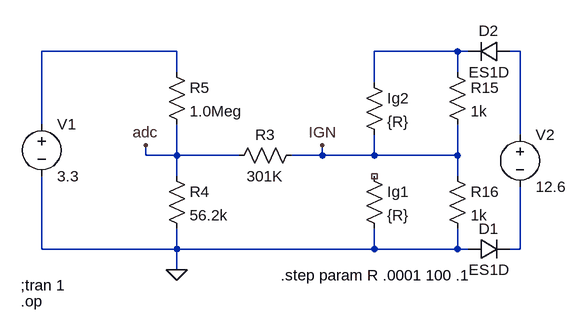
[diagram p0: schematic Cont1Netv2.asc]
Cont1Netv2.asc, the LTspice schematic file:
Version 4
SHEET 1 1220 680
WIRE 160 0 -48 0
WIRE 592 0 464 0
WIRE 608 0 592 0
WIRE 688 0 672 0
WIRE 160 32 160 0
WIRE 592 32 592 0
WIRE 464 48 464 0
WIRE -48 112 -48 0
WIRE 688 128 688 0
WIRE 112 160 112 144
WIRE 160 160 160 112
WIRE 160 160 112 160
WIRE 256 160 160 160
WIRE 384 160 384 144
WIRE 384 160 336 160
WIRE 464 160 464 128
WIRE 464 160 384 160
WIRE 592 160 592 112
WIRE 592 160 464 160
WIRE 160 192 160 160
WIRE 592 192 592 160
WIRE -48 304 -48 192
WIRE 160 304 160 272
WIRE 160 304 -48 304
WIRE 464 304 464 272
WIRE 464 304 160 304
WIRE 592 304 592 272
WIRE 592 304 464 304
WIRE 608 304 592 304
WIRE 688 304 688 208
WIRE 688 304 672 304
WIRE 160 336 160 304
FLAG 160 336 0
FLAG 112 144 adc
FLAG 384 144 IGN
SYMBOL voltage -48 96 R0
WINDOW 123 0 0 Left 2
WINDOW 39 0 0 Left 2
SYMATTR InstName V1
SYMATTR Value 3.3
SYMBOL res 144 16 R0
SYMATTR InstName R5
SYMATTR Value 1.0Meg
SYMBOL res 144 176 R0
SYMATTR InstName R4
SYMATTR Value 56.2k
SYMBOL res 352 144 R90
WINDOW 0 0 56 VBottom 2
WINDOW 3 32 56 VTop 2
SYMATTR InstName R3
SYMATTR Value 301K
SYMBOL voltage 688 112 R0
WINDOW 123 0 0 Left 2
WINDOW 39 0 0 Left 2
SYMATTR InstName V2
SYMATTR Value 12.6
SYMBOL res 448 176 R0
SYMATTR InstName Ig1
SYMATTR Value {R}
SYMBOL res 576 16 R0
SYMATTR InstName R15
SYMATTR Value 1k
SYMBOL res 576 176 R0
SYMATTR InstName R16
SYMATTR Value 1k
SYMATTR SpiceLine tol=1% pwr=.25
SYMBOL res 448 32 R0
SYMATTR InstName Ig2
SYMATTR Value {R}
SYMBOL diode 672 -16 R90
WINDOW 0 0 32 VBottom 2
WINDOW 3 32 32 VTop 2
SYMATTR InstName D2
SYMATTR Value ES1D
SYMBOL diode 608 320 R270
WINDOW 0 32 32 VTop 2
WINDOW 3 0 32 VBottom 2
SYMATTR InstName D1
SYMATTR Value ES1D
TEXT -80 360 Left 2 !;tran 1
TEXT 320 344 Left 2 !.step param R .0001 100 .1
TEXT -80 384 Left 2 !.op

The netlist it stands for:
* Cont1Netv2.asc
V1 N001 0 3.3
R5 N001 adc 1.0Meg
R4 adc 0 56.2k
R3 IGN adc 301K
V2 N003 N004 12.6
R§Ig1 NC_01 0 {R}
R15 N002 IGN 1k
R16 IGN 0 1k tol=1% pwr=.25
R§Ig2 N002 IGN {R}
D2 N003 N002 ES1D
D1 0 N004 ES1D
.model D D
.lib standard.dio
;tran 1
.step param R .0001 100 .1
.op
.backanno
.end